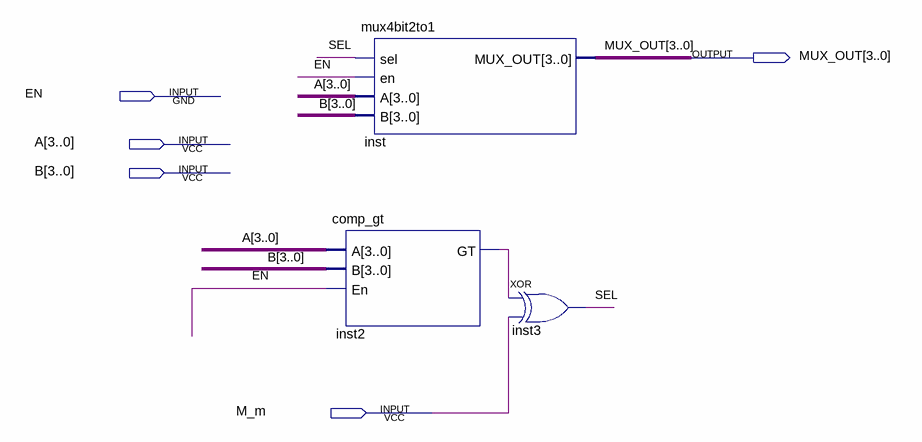
[diagram p0: schematic sheet]
// Quartus schematic PR2_MAYOR_MENOR.bdf as structural Verilog: 3 symbols, 5 pins
module PR2_MAYOR_MENOR (
  input  EN,
  input  [3:0] A,
  input  [3:0] B,
  input  M_m,
  output [3:0] MUX_OUT
);

  wire inst2_gt, SEL;

  mux4bit2to1 inst (.sel(SEL), .en(EN), .A(A), .B(B), .MUX_OUT(MUX_OUT));
  comp_gt inst2 (.A(A), .B(B), .En(EN), .GT(inst2_gt));
  xor inst3 (SEL, inst2_gt, M_m);
endmodule
